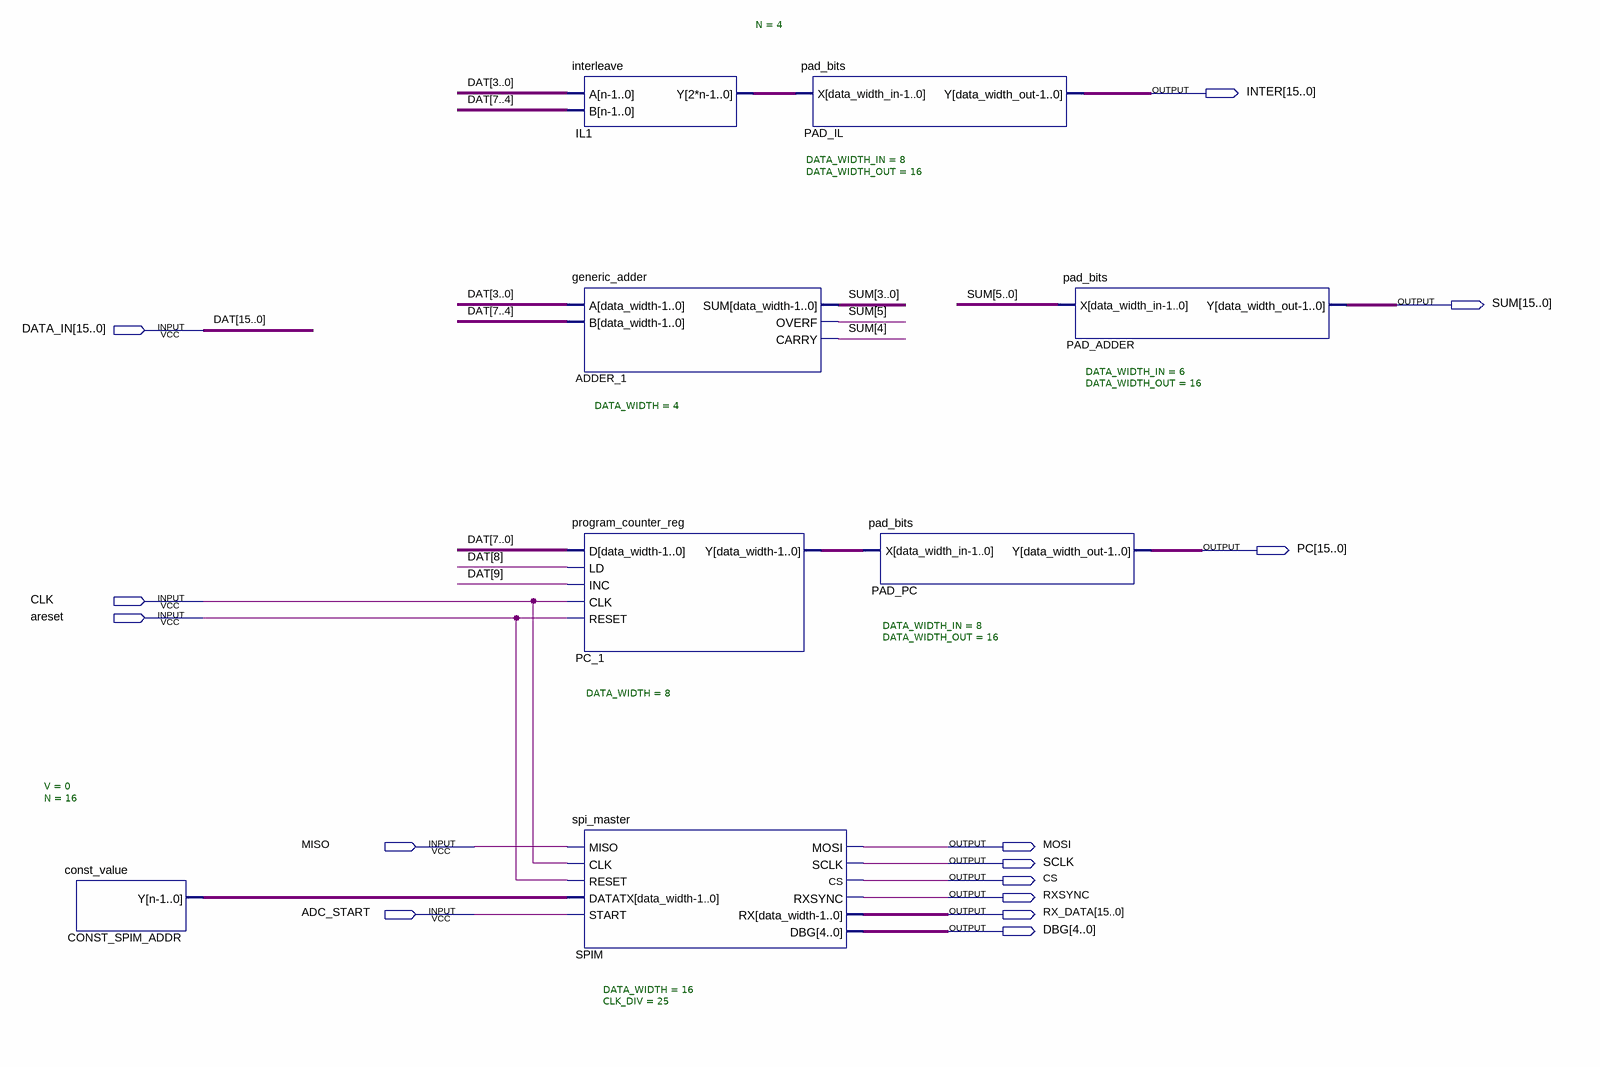
[diagram p0: schematic sheet]
// Quartus schematic uut.bdf as structural Verilog: 8 symbols, 14 pins
module uut (
  input  [15:0] DATA_IN,
  input  CLK,
  input  areset,
  input  MISO,
  input  ADC_START,
  output [15:0] INTER,
  output [15:0] SUM,
  output [15:0] PC,
  output MOSI,
  output SCLK,
  output CS,
  output RXSYNC,
  output [15:0] RX_DATA,
  output [4:0] DBG
);

  wire [7:0] IL1_y, PC_1_y;
  wire [15:0] CONST_SPIM_ADDR_y;

  const_value #(.V(0), .N(16)) CONST_SPIM_ADDR (.Y(CONST_SPIM_ADDR_y));
  interleave #(.N(4)) IL1 (.A(DATA_IN[3:0]), .B(DATA_IN[7:4]), .Y(IL1_y));
  generic_adder #(.DATA_WIDTH(4)) ADDER_1 (
    .A(DATA_IN[3:0]), .B(DATA_IN[7:4]), .SUM(SUM[3:0]), .OVERF(SUM[5]), .CARRY(SUM[4]));
  program_counter_reg #(.DATA_WIDTH(8)) PC_1 (
    .D(DATA_IN[7:0]), .LD(DATA_IN[8]), .INC(DATA_IN[9]), .CLK(CLK), .RESET(areset), .Y(PC_1_y));
  spi_master #(.DATA_WIDTH(16), .CLK_DIV(25)) SPIM (
    .MISO(MISO), .CLK(CLK), .RESET(areset), .DATATX(CONST_SPIM_ADDR_y), .START(ADC_START), .MOSI(MOSI),
    .SCLK(SCLK), .CS(CS), .RXSYNC(RXSYNC), .RX(RX_DATA), .DBG(DBG));
  pad_bits #(.DATA_WIDTH_IN(8), .DATA_WIDTH_OUT(16)) PAD_IL (.X(IL1_y), .Y(INTER));
  pad_bits #(.DATA_WIDTH_IN(8), .DATA_WIDTH_OUT(16)) PAD_PC (.X(PC_1_y), .Y(PC));
  pad_bits #(.DATA_WIDTH_IN(6), .DATA_WIDTH_OUT(16)) PAD_ADDER (.X(SUM[5:0]), .Y(SUM));

  // Other names for the same wires on the sheet: DAT[15:0] = DATA_IN
endmodule
